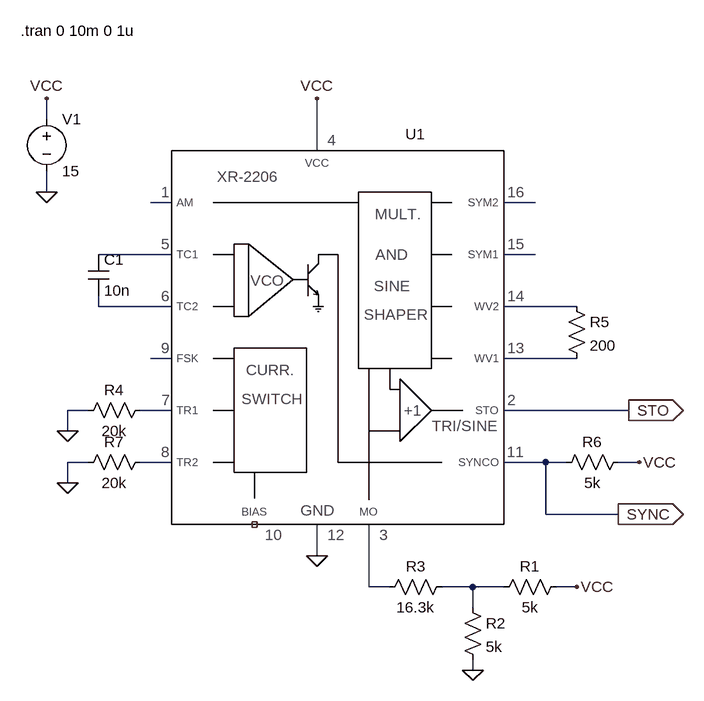
[diagram p0: schematic XR2206_test1.asc]
XR2206_test1.asc, the LTspice schematic file:
Version 4.1
SHEET 1 880 836
WIRE -208 -32 -208 -64
WIRE 208 16 208 -64
WIRE -208 80 -208 48
WIRE -16 96 -48 96
WIRE 544 96 496 96
WIRE -16 176 -128 176
WIRE 544 176 496 176
WIRE -128 256 -128 240
WIRE -16 256 -128 256
WIRE 608 256 496 256
WIRE -16 336 -48 336
WIRE 608 336 496 336
WIRE -144 416 -176 416
WIRE -16 416 -64 416
WIRE 688 416 496 416
WIRE -176 448 -176 416
WIRE -144 496 -176 496
WIRE -16 496 -64 496
WIRE 560 496 496 496
WIRE 592 496 560 496
WIRE 704 496 672 496
WIRE -176 528 -176 496
WIRE 560 576 560 496
WIRE 672 576 560 576
WIRE 208 640 208 592
WIRE 288 688 288 592
WIRE 320 688 288 688
WIRE 448 688 400 688
WIRE 496 688 448 688
WIRE 608 688 576 688
WIRE 448 720 448 688
WIRE 448 816 448 800
FLAG 208 -64 VCC
FLAG 208 640 0
FLAG 448 816 0
FLAG 608 688 VCC
FLAG -176 448 0
FLAG -208 80 0
FLAG -208 -64 VCC
FLAG 704 496 VCC
FLAG 672 576 SYNC
IOPIN 672 576 Out
FLAG 688 416 STO
IOPIN 688 416 Out
FLAG -176 528 0
SYMBOL res 592 672 R90
WINDOW 0 0 56 VBottom 0
WINDOW 3 32 56 VTop 0
SYMATTR InstName R1
SYMATTR Value 5k
SYMBOL res 432 704 R0
SYMATTR InstName R2
SYMATTR Value 5k
SYMBOL res 304 704 R270
WINDOW 0 32 56 VTop 0
WINDOW 3 0 56 VBottom 0
SYMATTR InstName R3
SYMATTR Value 16.3k
SYMBOL cap -144 176 R0
SYMATTR InstName C1
SYMATTR Value 10n
SYMBOL res -160 432 R270
WINDOW 0 32 56 VTop 0
WINDOW 3 0 56 VBottom 0
SYMATTR InstName R4
SYMATTR Value 20k
SYMBOL res 592 240 R0
SYMATTR InstName R5
SYMATTR Value 200
SYMBOL voltage -208 -48 R0
SYMATTR InstName V1
SYMATTR Value 15
SYMBOL res 688 480 R90
WINDOW 0 0 56 VBottom 0
WINDOW 3 32 56 VTop 0
SYMATTR InstName R6
SYMATTR Value 5k
SYMBOL res -160 512 R270
WINDOW 0 32 56 VTop 0
WINDOW 3 0 56 VBottom 0
SYMATTR InstName R7
SYMATTR Value 20k
SYMBOL ZmySymbol\\IC\\XR2206 80 176 R0
SYMATTR InstName U1
TEXT -248 -168 Left 0 !.tran 0 10m 0 1u

The netlist it stands for:
* XR2206_test1.asc
R1 VCC N012 5k
R2 N012 0 5k
R3 N011 N012 16.3k
C1 N003 N005 10n
R4 0 N009 20k
R5 N006 N008 200
V1 VCC 0 15
R6 VCC SYNC 5k
R7 0 N010 20k
X§U1 N001 STO N011 VCC N003 N005 N009 N010 N007 NC_01 SYNC 0 N008 N006 N004 N002 XR2206  ; pins AM STO MO VCC TC1 TC2 TR1 TR2 FSK BIAS SYNCO COM WV1 WV2 SYM1 SYM2
.tran 0 10m 0 1u
.lib XR2206.sub
.backanno
.end